# EAGLE schematic powerCircuit (EAGLE 7.6.0)
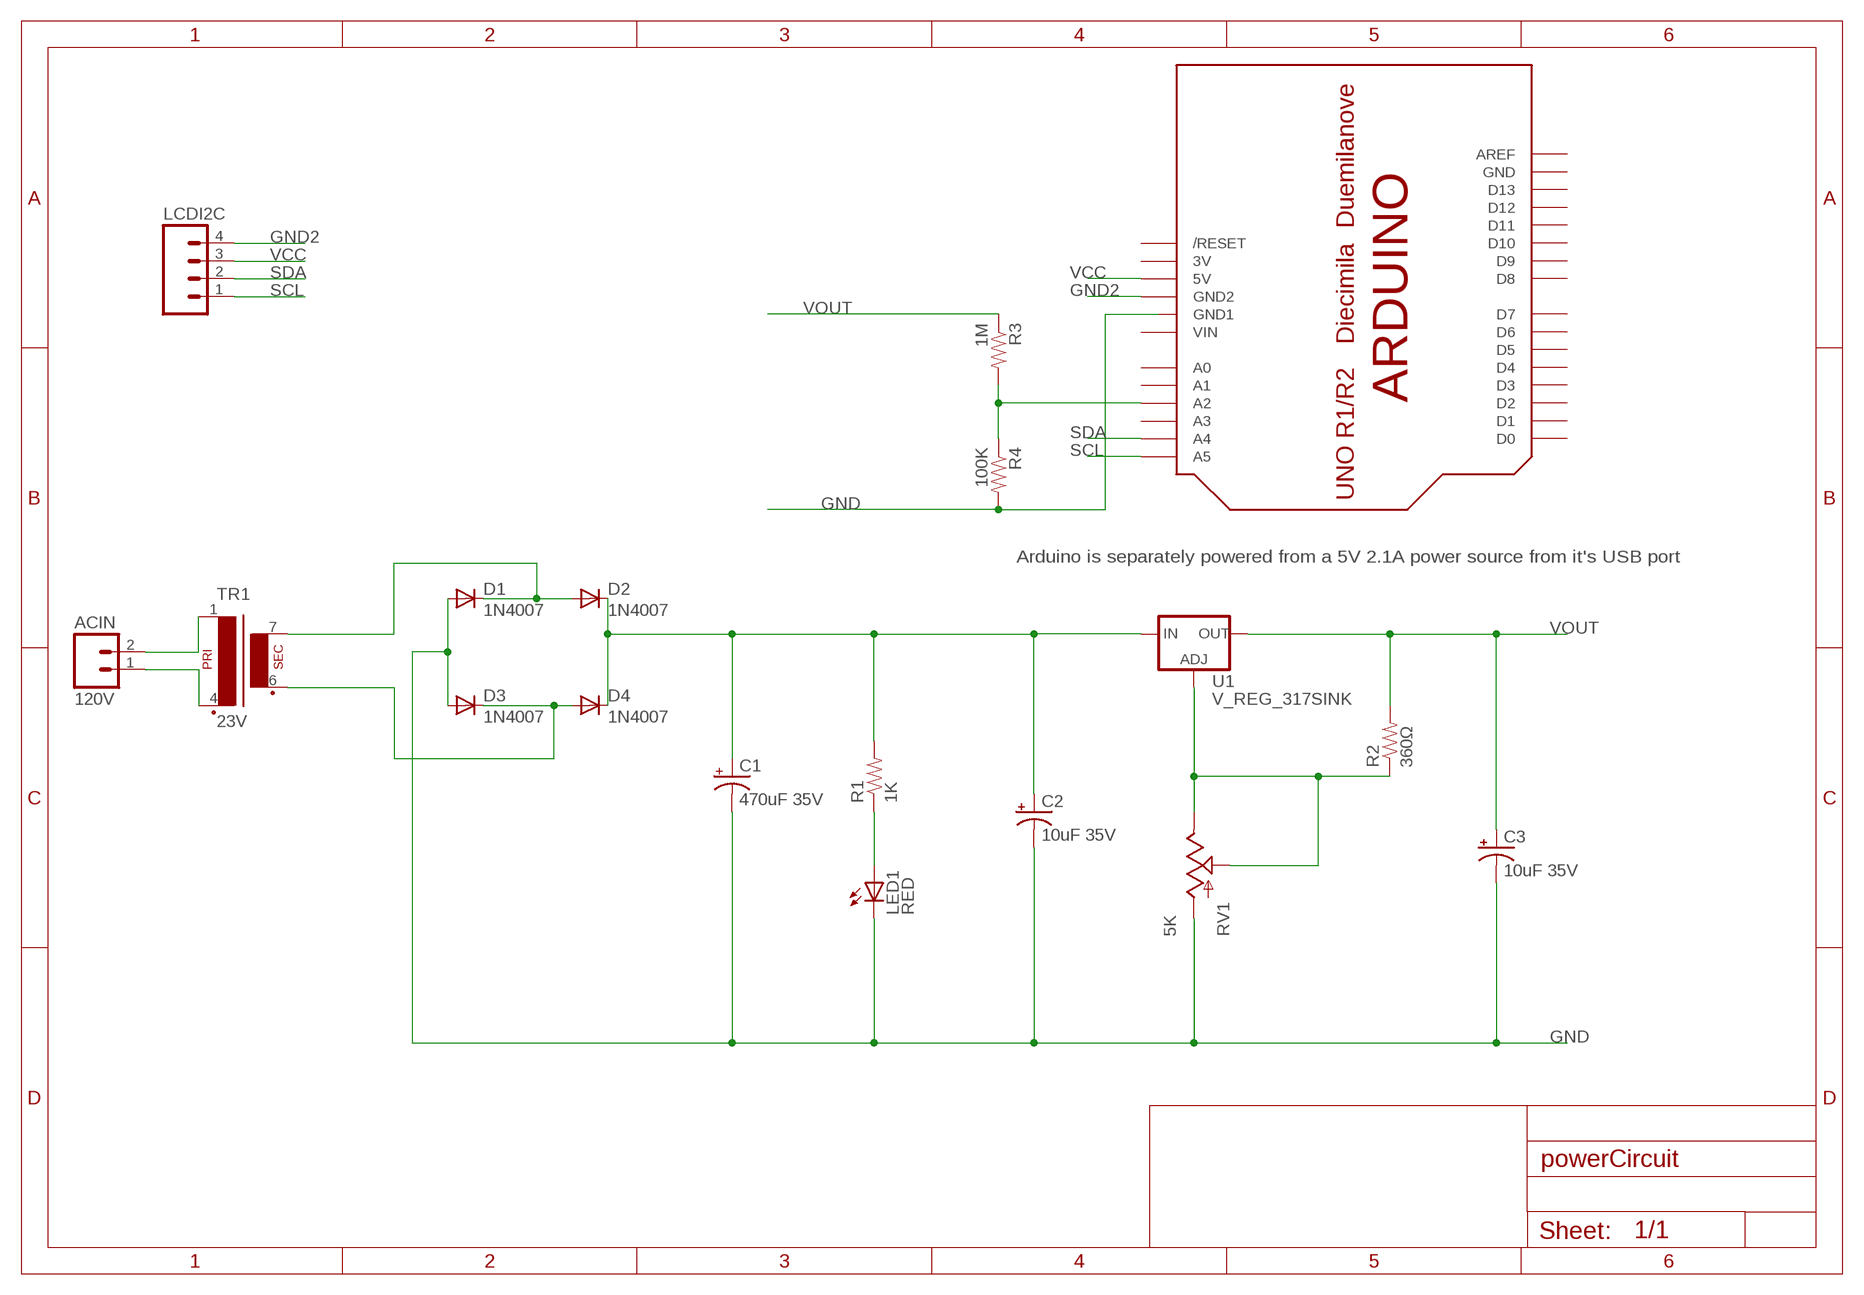
[diagram p0: schematic, sheet 1]

## Parts
ACIN  120V  M02POGO_PIN_HOLES_ONLY  [1X02_PP_HOLES_ONLY]
C1  470uF 35V  CPOL-USE5-5  [E5-5]
C2  10uF 35V  CPOL-USE5-5  [E5-5]
C3  10uF 35V  CPOL-USE5-5  [E5-5]
D1  1N4004  [DO41-10]
D2  1N4004  [DO41-10]
D3  1N4004  [DO41-10]
D4  1N4004  [DO41-10]
LCDI2C  M04LONGPADS  [1X04_LONGPADS]
LED1  RED  LED5MM  [LED5MM]
R1  1K  RESISTORPTH-1/2W  [AXIAL-0.5]
R2  360Ω  RESISTORPTH-1/2W  [AXIAL-0.5]
R3  1M  RESISTORPTH-1/2W  [AXIAL-0.5]
R4  100K  RESISTORPTH-1/2W  [AXIAL-0.5]
RV1  5K  POT-RV16AF-20  [POT_ALPHA_RV16AF-20]
TR1  23V  EE20-1  [EE20-1]
U1  V_REG_317SINK  [TO220-ADJ]
U$1  ARDUINOUNO  [ARDUINO]

## Nets
GND: C1.- C2.- C3.- D1.A D3.A LED1.K(C) R4.P$2 RV1.1(A)
GND2: LCDI2C.4 U$1.GND2
N$1: D1.C D2.A TR1.7(S4)
N$2: D3.C D4.A TR1.6(S3)
N$3: LED1.A R1.P$1
N$4: R3.P$2 R4.P$1 U$1.A2
N$5: R2.P$1 RV1.2(S) RV1.3(E) U1.ADJ
N$6: ACIN.1 TR1.4(P2)
N$7: ACIN.2 TR1.1
SCL: LCDI2C.1 U$1.A5
SDA: LCDI2C.2 U$1.A4
VCC: LCDI2C.3 U$1.5V
VOUT: C1.+ C2.+ C3.+ D2.C D4.C R1.P$2 R2.P$2 R3.P$1 U1.IN U1.OUT
Unconnected: U$1.A0 U$1.A1 U$1.A3 U$1.AREF U$1.D0 U$1.D1 U$1.D2 U$1.D3 U$1.D4 U$1.D5 U$1.D6 U$1.D7 U$1.D8 U$1.D9 U$1.D10 U$1.D11 U$1.D12 U$1.D13 U$1.RESET(/RESET)

## Notes on the sheet
- Arduino is separately powered from a 5V 2.1A power source from it's USB port
- 1N4007 | 1N4007
- 1N4007 | 1N4007

## Power pins joined to a net without a drawn wire
3V: U$1.3V
GND: U$1.GND
GND1: U$1.GND1
VIN: U$1.VIN

## Library data of the parts
ACIN = SparkFun-Connectors:M02: Standard 2-pin 0.1" header. Use with - straight break away headers ( PRT-00116) - right angle break away headers (PRT-00553) - swiss pins (PRT-00743) - machine pins (PRT-00117) - female headers (PRT-00115) Molex polarized connector foot print use with: PRT-08233 with associated crimp pins and housings. 2.54_SCREWTERM for use with PRT-10571. 3.5mm Screw Terminal footprints for PRT-08084 5mm Screw Terminal footprints for use with PRT-08432
C1-C3 = adafruit:CPOL-US: POLARIZED CAPACITOR, American symbol
D1-D4 = diode:1N4004: DIODE general purpose rectifier, 1 A
LCDI2C = SparkFun-Connectors:M04: Header 4 Standard 4-pin 0.1" header. Use with straight break away headers (SKU : PRT-00116), right angle break away headers (PRT-00553), swiss pins (PRT-00743), machine pins (PRT-00117), and female headers (PRT-00115). Molex polarized connector foot print use with SKU : PRT-08231 with associated crimp pins and housings. 1MM SMD Version SKU: PRT-10208; PROD_ID: CONN-09696
LED1 = adafruit:LED: LED OSRAM: - CHIPLED LG R971, LG N971, LY N971, LG Q971, LY Q971, LO R971, LY R971 LH N974, LH R974 LS Q976, LO Q976, LY Q976 LO Q996 - Hyper CHIPLED LW Q18S LB Q993, LB Q99A, LB R99A - SideLED LS A670, LO A670, LY A670, LG A670, LP A670 LB A673, LV A673, LT A673, LW A673 LH A674 LY A675 LS A676, LA A676, LO A676, LY A676, LW A676 LS A679, LY A679, LG A679 - Hyper Micro SIDELED® LS Y876, LA Y876, LO Y876, LY Y876 LT Y87S - SmartLED LW L88C, LW L88S LB L89C, LB L89S, LG L890 LS L89K, LO L89K, LY L89K LS L896, LA L896, LO L896, LY L896 - TOPLED LS T670, LO T670, LY T670, LG T670, LP T670 LSG T670, LSP T670, LSY T670, LOP T670, LYG T670 LG T671, LOG T671, LSG T671 LB T673, LV T673, LT T673, LW T673 LH T674 LS T676, LA T676, LO T676, LY T676, LB T676, LH T676, LSB T676, LW T676 LB T67C, LV T67C, LT T67C, LS T67K, LO T67K, LY T67K, LW E67C LS E67B, LA E67B, LO E67B, LY E67B, LB E67C, LV E67C, LT E67C LW T67C LS T679, LY T679, LG T679 LS T770, LO T770, LY T770, LG T770, LP T770 LB T773, LV T773, LT T773, LW T773 LH T774 LS E675, LA E675, LY E675, LS T675 LS T776, LA T776, LO T776, LY T776, LB T776 LHGB T686 LT T68C, LB T68C - Hyper Mini TOPLED® LB M676 - Mini TOPLED Santana® LG M470 LS M47K, LO M47K, LY M47K Source: http://www.osram.convergy.de/
R1-R4 = SparkFun-Passives:RESISTOR: Resistor Basic schematic elements and footprints for 0603, 1206, and PTH resistors.
RV1 = SparkFun-Electromechanical:POT
TR1 = trafo:EE20-1: TRANSFORMER 1 primary winding, 1 secondary winding ERA
U1 = SparkFun-PowerIC:V_REG_317: Voltage Regulator Standard LM317 adjustable voltage regulator. AOI (Adjust Output Input). Google 'LM317 Calculator' for easy to use app to get the two resistor values needed. 240/720 for 5V output. 240/390 for 3.3V output. Spark Fun Electronics SKU : COM-00527
U$1 = adafruit:ARDUINO: Arduino Diecimila/Duemilanove Make a shield with ease, this package has all the named pins as well as the two mounting drill holes and an outline of the USB and DC power connector. The outline is on the DIMENSION layer, so if your board house uses it they will cut the outline to match. http://www.ladyada.net/library/pcb/eaglelibrary.html